# Altium schematic sheet 3_JetsonDRAMConnector.SchDoc
size 381 x 241 mm
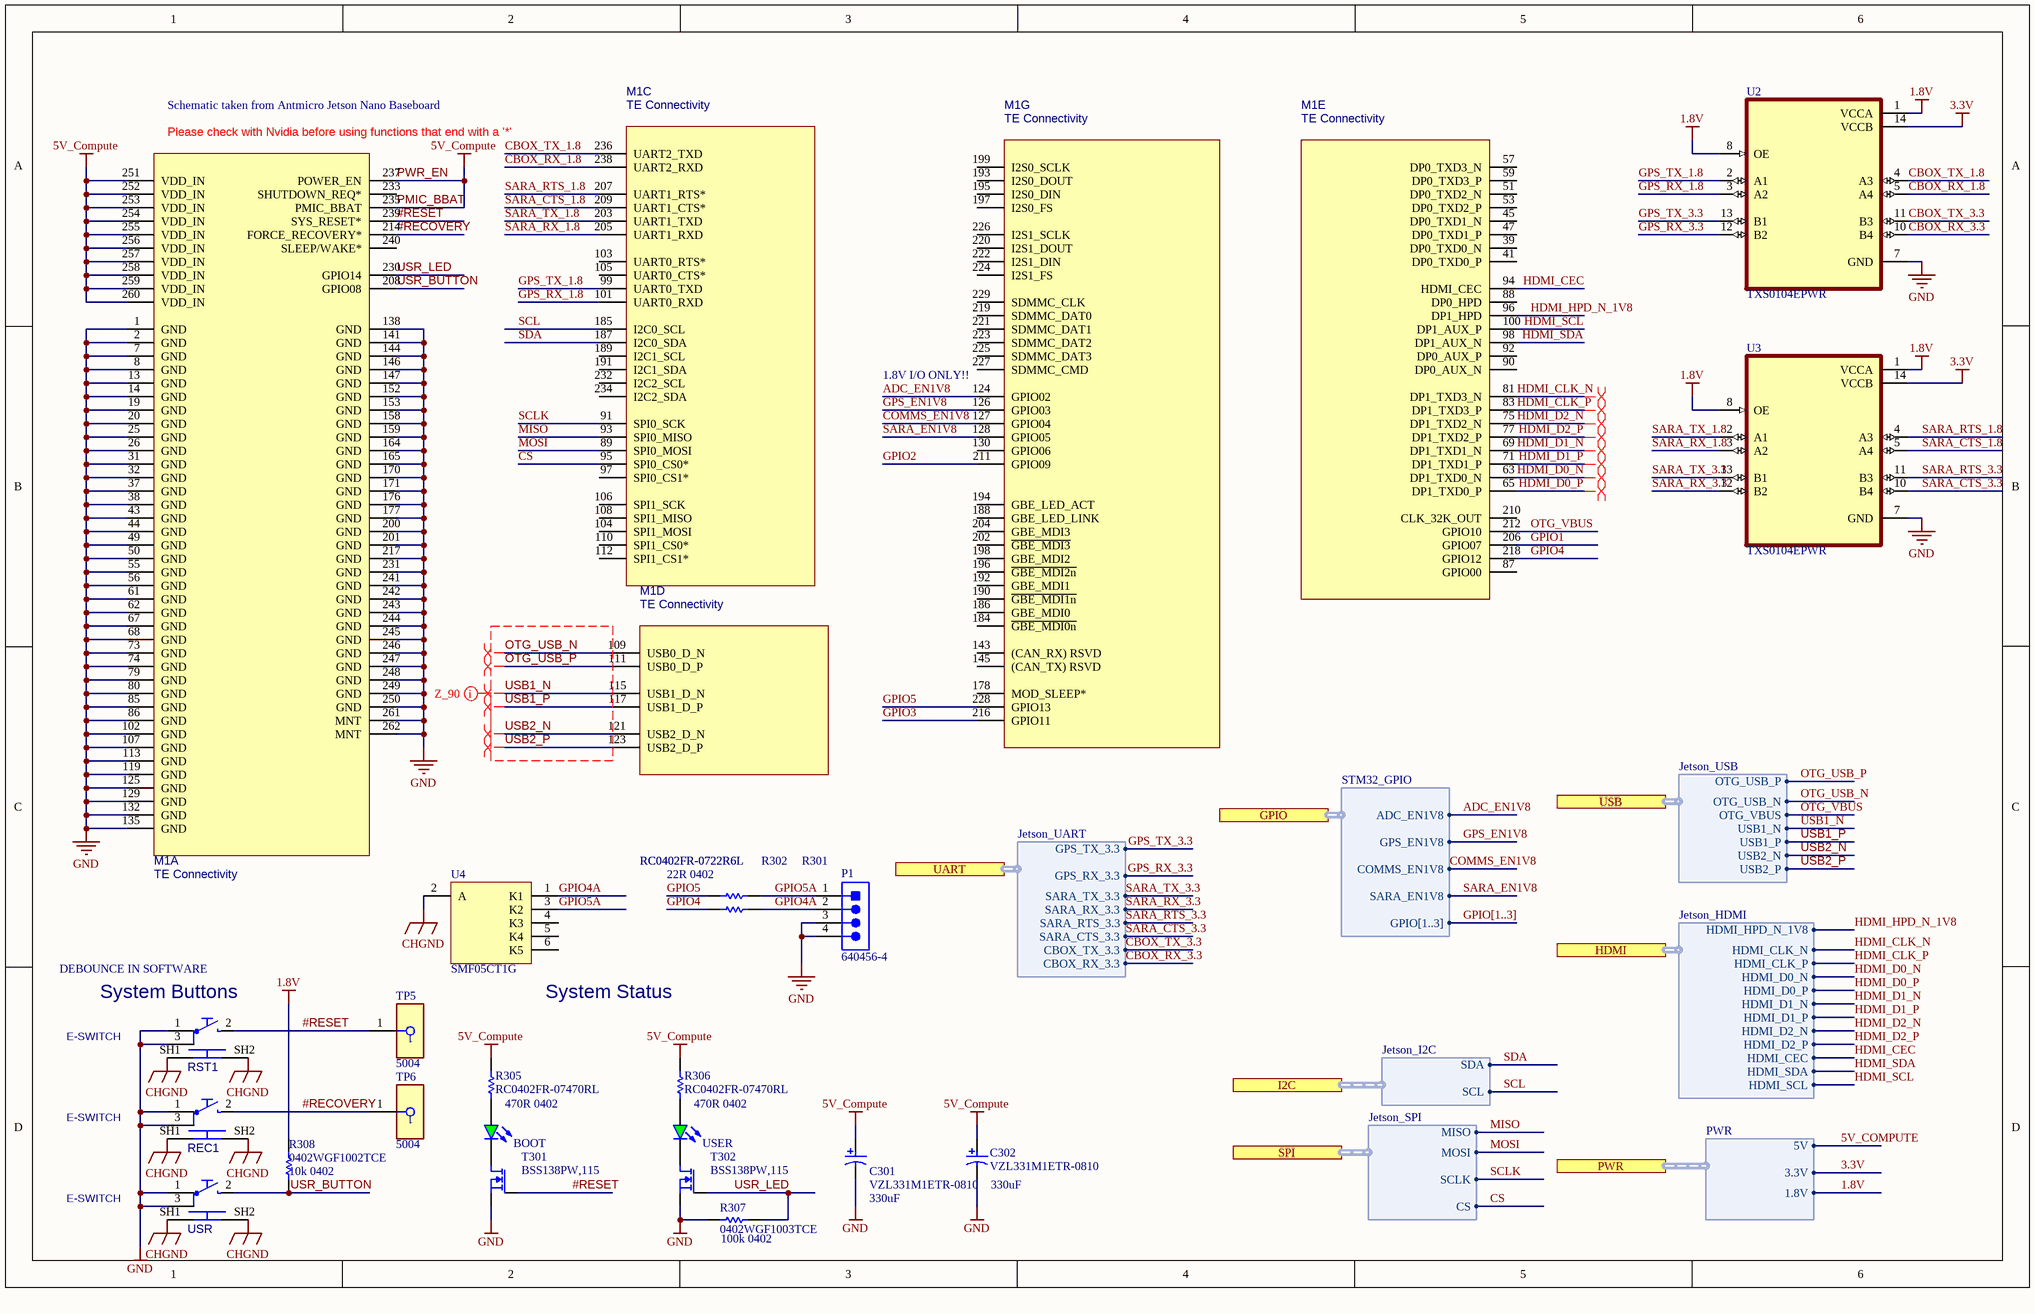
[diagram p0: 3_JetsonDRAMConnector.SchDoc]

## Parts
(Parts that share a designator on the sheet are numbered #1, #2 ... from top to bottom, then left to right.)
BOOT  APT1608SGC  [LED0603]  (value not drawn)
C301  VZL331M1ETR-0810  [NIC-CAPA2-8X10_V]
C302  VZL331M1ETR-0810  [NIC-CAPA2-8X10_V]
M1#1  Manufacturer: TE Connectivity  [jetson-nano-connector]  (hidden comment: 2309413-1)  (part E of 7)
M1#2  Manufacturer: TE Connectivity  [jetson-nano-connector]  (hidden comment: 2309413-1)  (parts A,C,D,G of 7)
P1  640456-4  [TECO-640456-4]
R301  RC0402FR-0722R6L  [0402]
R302  RC0402FR-0722R6L  [0402]
R305  RC0402FR-07470RL  [0402]
R306  RC0402FR-07470RL  [0402]
R307  0402WGF1003TCE  [0402]
R308  0402WGF1002TCE  [0402]
REC1  Manufacturer: E-SWITCH  [TL3340AF160QG]  (hidden comment: TL3340AF160QG)
RST1  Manufacturer: E-SWITCH  [TL3340AF160QG]  (hidden comment: TL3340AF160QG)
T301  BSS138PW,115  [SC70-3]
T302  BSS138PW,115  [SC70-3]
TP5  5004  [FP-5004-MFG]
TP6  5004  [FP-5004-MFG]
U2  TXS0104EPWR  [SOP65P640X120-14N]
U3  TXS0104EPWR  [SOP65P640X120-14N]
U4  SMF05CT1G  [ONSC-SC70-6-419B-02_W_V]
USER  APT1608SGC  [LED0603]  (value not drawn)
USR  Manufacturer: E-SWITCH  [TL3340AF160QG]  (hidden comment: TL3340AF160QG)

## Ports
GPIO (harness STM32_GPIO), HDMI (harness Jetson_HDMI), I2C (harness Jetson_I2C), PWR (harness PWR), SPI (harness Jetson_SPI), UART (harness Jetson_UART), USB (harness Jetson_USB)

## Harnesses
Jetson_UART: GPS_TX_3.3, GPS_RX_3.3, SARA_TX_3.3, SARA_RX_3.3, CBOX_TX_3.3, CBOX_RX_3.3, SARA_RTS_3.3, SARA_CTS_3.3
Jetson_I2C: SDA, SCL
Jetson_USB: OTG_USB_P, OTG_USB_N, USB1_N, USB1_P, USB2_N, USB2_P, OTG_VBUS
Jetson_SPI: MISO, MOSI, SCLK, CS
Jetson_HDMI: HDMI_HPD_N_1V8, HDMI_CLK_N, HDMI_CLK_P, HDMI_D0_N, HDMI_D0_P, HDMI_D1_N, HDMI_D1_P, HDMI_D2_N, HDMI_D2_P, HDMI_CEC, HDMI_SDA, HDMI_SCL
STM32_GPIO: ADC_EN1V8, GPS_EN1V8, COMMS_EN1V8, SARA_EN1V8, GPIO[1..3]
PWR: 5V, 3.3V, 1.8V

## Nets
1.8V: R308.1 U2.1(VCCA) U2.8(OE) U3.1(VCCA) U3.8(OE) ; port PWR.1.8V
3.3V: U2.14(VCCB) U3.14(VCCB) ; port PWR.3.3V
5V_COMPUTE: C301.1 C302.1 M1#2.235(PMIC_BBAT) M1#2.237(POWER_EN) M1#2.251(VDD_IN) M1#2.252(VDD_IN) M1#2.253(VDD_IN) M1#2.254(VDD_IN) M1#2.255(VDD_IN) M1#2.256(VDD_IN) M1#2.257(VDD_IN) M1#2.258(VDD_IN) M1#2.259(VDD_IN) M1#2.260(VDD_IN) R305.1 R306.1 ; port PWR.5V  [also labelled PMIC_BBAT, PWR_EN]
CHGND: REC1.SH1 REC1.SH2 RST1.SH1 RST1.SH2 U4.2(A) USR.SH1 USR.SH2
GND: C301.2 C302.2 M1#2.1(GND) M1#2.2(GND) M1#2.7(GND) M1#2.8(GND) M1#2.13(GND) M1#2.14(GND) M1#2.19(GND) M1#2.20(GND) M1#2.25(GND) M1#2.26(GND) M1#2.31(GND) M1#2.32(GND) M1#2.37(GND) M1#2.38(GND) M1#2.43(GND) M1#2.44(GND) M1#2.49(GND) M1#2.50(GND) M1#2.55(GND) M1#2.56(GND) M1#2.61(GND) M1#2.62(GND) M1#2.67(GND) M1#2.68(GND) M1#2.73(GND) M1#2.74(GND) M1#2.79(GND) M1#2.80(GND) M1#2.85(GND) M1#2.86(GND) M1#2.102(GND) M1#2.107(GND) M1#2.113(GND) M1#2.119(GND) M1#2.125(GND) M1#2.129(GND) M1#2.132(GND) M1#2.135(GND) M1#2.138(GND) M1#2.141(GND) M1#2.144(GND) M1#2.146(GND) M1#2.147(GND) M1#2.152(GND) M1#2.153(GND) M1#2.158(GND) M1#2.159(GND) M1#2.164(GND) M1#2.165(GND) M1#2.170(GND) M1#2.171(GND) M1#2.176(GND) M1#2.177(GND) M1#2.200(GND) M1#2.201(GND) M1#2.217(GND) M1#2.231(GND) M1#2.241(GND) M1#2.242(GND) M1#2.243(GND) M1#2.244(GND) M1#2.245(GND) M1#2.246(GND) M1#2.247(GND) M1#2.248(GND) M1#2.249(GND) M1#2.250(GND) M1#2.261(MNT) M1#2.262(MNT) P1.3 P1.4 R307.1 REC1.1 REC1.3 RST1.1 RST1.3 T301.2(S) T302.2(S) U2.7(GND) U3.7(GND) USR.1 USR.3
#RECOVERY: M1#2.214(FORCE_RECOVERY*) REC1.2 TP6.1
#RESET: M1#2.239(SYS_RESET*) RST1.2 T301.1(G) TP5.1
ADC_EN1V8: M1#2.124(GPIO02) ; port GPIO.ADC_EN1V8
CBOX_RX_1.8: M1#2.238(UART2_RXD) U2.5(A4)
CBOX_RX_3.3: U2.10(B4) ; port UART.CBOX_RX_3.3
CBOX_TX_1.8: M1#2.236(UART2_TXD) U2.4(A3)
CBOX_TX_3.3: U2.11(B3) ; port UART.CBOX_TX_3.3
COMMS_EN1V8: M1#2.127(GPIO04) ; port GPIO.COMMS_EN1V8
CS: M1#2.95(SPI0_CS0*) ; port SPI.CS
GPIO1: M1#1.206(GPIO07)
GPIO2: M1#2.211(GPIO09)
GPIO3: M1#2.216(GPIO11)
GPIO4: M1#1.218(GPIO12) R302.1
GPIO4A: P1.2 R302.2 U4.1(K1)
GPIO5: M1#2.228(GPIO13) R301.1
GPIO5A: P1.1 R301.2 U4.3(K2)
GPS_EN1V8: M1#2.126(GPIO03) ; port GPIO.GPS_EN1V8
GPS_RX_1.8: M1#2.101(UART0_RXD) U2.3(A2)
GPS_RX_3.3: U2.12(B2) ; port UART.GPS_RX_3.3
GPS_TX_1.8: M1#2.99(UART0_TXD) U2.2(A1)
GPS_TX_3.3: U2.13(B1) ; port UART.GPS_TX_3.3
HDMI_CEC: M1#1.94(HDMI_CEC) ; port HDMI.HDMI_CEC
HDMI_CLK_N: M1#1.81(DP1_TXD3_N) ; port HDMI.HDMI_CLK_N
HDMI_CLK_P: M1#1.83(DP1_TXD3_P) ; port HDMI.HDMI_CLK_P
HDMI_D0_N: M1#1.63(DP1_TXD0_N) ; port HDMI.HDMI_D0_N
HDMI_D0_P: M1#1.65(DP1_TXD0_P) ; port HDMI.HDMI_D0_P
HDMI_D1_N: M1#1.69(DP1_TXD1_N) ; port HDMI.HDMI_D1_N
HDMI_D1_P: M1#1.71(DP1_TXD1_P) ; port HDMI.HDMI_D1_P
HDMI_D2_N: M1#1.75(DP1_TXD2_N) ; port HDMI.HDMI_D2_N
HDMI_D2_P: M1#1.77(DP1_TXD2_P) ; port HDMI.HDMI_D2_P
HDMI_HPD_N_1V8: M1#1.96(DP1_HPD) ; port HDMI.HDMI_HPD_N_1V8
HDMI_SCL: M1#1.100(DP1_AUX_P) ; port HDMI.HDMI_SCL
HDMI_SDA: M1#1.98(DP1_AUX_N) ; port HDMI.HDMI_SDA
MISO: M1#2.93(SPI0_MISO) ; port SPI.MISO
MOSI: M1#2.89(SPI0_MOSI) ; port SPI.MOSI
OTG_USB_N: M1#2.109(USB0_D_N) ; port USB.OTG_USB_N
OTG_USB_P: M1#2.111(USB0_D_P) ; port USB.OTG_USB_P
OTG_VBUS: M1#1.212(GPIO10) ; port USB.OTG_VBUS
SARA_CTS_1.8: M1#2.209(UART1_CTS*) U3.5(A4)
SARA_CTS_3.3: U3.10(B4) ; port UART.SARA_CTS_3.3
SARA_EN1V8: M1#2.128(GPIO05) ; port GPIO.SARA_EN1V8
SARA_RTS_1.8: M1#2.207(UART1_RTS*) U3.4(A3)
SARA_RTS_3.3: U3.11(B3) ; port UART.SARA_RTS_3.3
SARA_RX_1.8: M1#2.205(UART1_RXD) U3.3(A2)
SARA_RX_3.3: U3.12(B2) ; port UART.SARA_RX_3.3
SARA_TX_1.8: M1#2.203(UART1_TXD) U3.2(A1)
SARA_TX_3.3: U3.13(B1) ; port UART.SARA_TX_3.3
SCL: M1#2.185(I2C0_SCL) ; port I2C.SCL
SCLK: M1#2.91(SPI0_SCK) ; port SPI.SCLK
SDA: M1#2.187(I2C0_SDA) ; port I2C.SDA
USB1_N: M1#2.115(USB1_D_N) ; port USB.USB1_N
USB1_P: M1#2.117(USB1_D_P) ; port USB.USB1_P
USB2_N: M1#2.121(USB2_D_N) ; port USB.USB2_N
USB2_P: M1#2.123(USB2_D_P) ; port USB.USB2_P
USR_BUTTON: M1#2.208(GPIO08) R308.2 USR.2
USR_LED: M1#2.230(GPIO14) R307.2 T302.1(G)
NetBOOT_A: BOOT.A R305.2
NetBOOT_K: BOOT.K T301.3(D)
NetR306_2: R306.2 USER.A
NetT302_3: T302.3(D) USER.K

Not connected (* = marked no-connect by the designer): M1#1 39(DP0_TXD0_N) 41(DP0_TXD0_P) 45(DP0_TXD1_N) 47(DP0_TXD1_P) 51(DP0_TXD2_N) 53(DP0_TXD2_P) 57(DP0_TXD3_N) 59(DP0_TXD3_P) 87(GPIO00) 88(DP0_HPD) 90(DP0_AUX_N) 92(DP0_AUX_P) 210(CLK_32K_OUT); M1#2 97(SPI0_CS1*) 103(UART0_RTS*) 104(SPI1_MOSI) 105(UART0_CTS*) 106(SPI1_SCK) 108(SPI1_MISO) 110(SPI1_CS0*) 112(SPI1_CS1*) 130(GPIO06) 143((CAN_RX)_RSVD) 145((CAN_TX)_RSVD) 178(MOD_SLEEP*) 184(~{GBE_MDI0n}) 186(GBE_MDI0) 188(GBE_LED_LINK) 189(I2C1_SCL) 190(~{GBE_MDI1n}) 191(I2C1_SDA) 192(GBE_MDI1) 193(I2S0_DOUT) 194(GBE_LED_ACT) 195(I2S0_DIN) 196(~{GBE_MDI2n}) 197(I2S0_FS) 198(GBE_MDI2) 199(I2S0_SCLK) 202(~{GBE_MDI3}) 204(GBE_MDI3) 219(SDMMC_DAT0) 220(I2S1_DOUT) 221(SDMMC_DAT1) 222(I2S1_DIN) 223(SDMMC_DAT2) 224(I2S1_FS) 225(SDMMC_DAT3) 226(I2S1_SCLK) 227(SDMMC_CMD) 229(SDMMC_CLK) 232(I2C2_SCL) 233(SHUTDOWN_REQ*) 234(I2C2_SDA) 240(SLEEP/WAKE*); U4 4(K3) 5(K4) 6(K5)

## Buses and harness runs
bus GPIO[1..3]

## Layout directives
net class Z_90: OTG_USB_N, OTG_USB_P, USB1_N, USB1_P, USB2_N, USB2_P
differential pair: HDMI_CLK_N, HDMI_CLK_P, HDMI_D0_N, HDMI_D0_P, HDMI_D1_N, HDMI_D1_P, HDMI_D2_N, HDMI_D2_P, OTG_USB_N, OTG_USB_P, USB1_N, USB1_P, USB2_N, USB2_P

## Notes on the sheet
- Schematic taken from Antmicro Jetson Nano Baseboard
- (near M1#2) 1.8V I/O ONLY!!
- (near R301) 22R 0402
- DEBOUNCE IN SOFTWARE
- (near RST1) System Buttons
- (near U4) System Status
- 470R 0402
- (near R308) 10k 0402
- (near R307) 100k 0402
- (near C301) 330uF
- (near C302) 330uF
- (in symbol jetson-nano-new-release, part A) Please check with Nvidia before using functions that end with a '*'

## Library data of the parts
BOOT USER = LED: LED Green 0603 case; PartNumber: LED_G; Manufacturer: KINGBRIGHT; Value: APT1608SGC; MPN: APT1608SGC
C301 C302 = CMP-0687-00072-1: Aluminum Electrolytic Capacitor, UD Series, Low Impedance, 330 uF, 10 V, + / - 20%, -55 to 105 degC, Chip Type, 8 x 10 mm D x L, Pb-Free, Reel; PartNumber: UUD1A331MNL1GS; Manufacturer: Nichicon; Rated Capacitance: 330 uF; Packing: Dia382mm Reel; Tolerance Rated Capacitance: -20 to 20%; Endurance Time: 5000 h; Rated Ripple Current (at 100kHz): 450 mA; Rated Voltage: 10 V; Impedance: 0.17 Ohm; ComponentLink1URL: http://www.nichicon.co.jp/; DatasheetVersion: 08/2012; ComponentLink2URL: http://products.nichicon.co.jp/en/pdf/XJA043/e-ud.pdf; Diameter: 8 mm; ComponentLink1Description: Manufacturer URL; PackageDescription: 2-Pin Surface Mount Device, Diameter 8 mm, Height 10 mm, Pitch 6.5 mm; Mounting Technology: Surface Mount; ComponentLink3URL: http://products.nichicon.co.jp/en/pdf/XJA043/e-ud.pdf; ComponentLink3Description: Package Specification; Length: 10 mm; ComponentLink2Description: Datasheet; PackageReference: CAPAE-D8H10; RoHS: TRUE
M1#1 M1#2 = jetson-nano-new-release: PartNumber: 2309413-1; Value: 2309413-1; MPN: 2309413-1
P1 = CMP-2000-05419-1: Male Header, Pitch 2.54 mm, 1 x 4 Position, Height 10.03 mm, Tail Length 3.56 mm, RoHS, Bulk; Manufacturer: TE Connectivity; Material, Housing: Polyester; Primary Type: InterconnectSystem; Mount Angle: Vertical; Color, Housing: White; Current, Rating: 5 / A; Agency Approvals: CSA,UL; Contact Termination Area Plating: Tin; Temperature, Operating: -55to+105 / degC; Standards: RoHSCompliant,ELVCompliant,UL94V-0; Number of Positions: 4; Brand/Series: MTA-100Series; Angle: Straight; Pin Spacing: 0.1 / "; Material, Contact: CopperAlloy; Connector Type: MTA-100; Special Features: Pinstrip; Mounting Hole Size: 0.04 / "; Contact Centerline Spacing: 0.100 / in.; Voltage, Rating: 250 / V; Manufacturer URL: http://www.te.com/; Length, Pin: 0.14 / "; Length, Overall: 0.4 / "; Color: White; Flammability Rating: UL94V-0; Mounting Type: PCMount; Termination: Solder; Datasheet URL: https://datasheet.ciiva.com/16286/eng-ds-82056-mta-0608-16286228.pdf; Number of Contacts: 4; Contact Shape: Square; Contact Mating Area Plating: Tin; Length, Terminal Post: 0.14 / in.; Size, Post: 0.025 / in.; Contact Plating: Tin; Type: PCBPlug; Datasheet Version: Dec-14; Number of Rows: 1
R301 R302 = Res1: 22R 0402; Published: 8-Jun-2000; LatestRevisionDate: 17-Jul-2002; LatestRevisionNote: Re-released for DXP Platform.; PackageReference: AXIAL-0.3; Publisher: Altium Limited; PackageDescription: Axial Device, Thru-Hole; 2 Leads; 0.3 in Pin Spacing; Case Code (Imperial): 0402
R305 R306 = Res1: 470R 0402; Published: 8-Jun-2000; LatestRevisionDate: 17-Jul-2002; LatestRevisionNote: Re-released for DXP Platform.; PackageReference: AXIAL-0.3; Publisher: Altium Limited; PackageDescription: Axial Device, Thru-Hole; 2 Leads; 0.3 in Pin Spacing; Case Code (Imperial): 0402
R307 = Res1: 100k 0402; Published: 8-Jun-2000; LatestRevisionDate: 17-Jul-2002; LatestRevisionNote: Re-released for DXP Platform.; PackageReference: AXIAL-0.3; Publisher: Altium Limited; PackageDescription: Axial Device, Thru-Hole; 2 Leads; 0.3 in Pin Spacing; Case Code (Imperial): 0402
R308 = Res1: 10k 0402; Published: 8-Jun-2000; LatestRevisionDate: 17-Jul-2002; LatestRevisionNote: Re-released for DXP Platform.; PackageReference: AXIAL-0.3; Publisher: Altium Limited; PackageDescription: Axial Device, Thru-Hole; 2 Leads; 0.3 in Pin Spacing; Case Code (Imperial): 0402
REC1 RST1 USR = TL3340AF160QG: E-SWITCH  TL3340AF160QG  SWITCH, TACTILE SPST 50mA, SMD GULL WING; Value: TL3340AF160QG; PartNumber: TL3340AF160QG; MPN: TL3340AF160QG
T301 T302 = NMOS: MOSFET, N CH, 60V, 0.2A; Manufacturer: NXP; Value: BSS138PW,115; PartNumber: BSS138PW,115; MPN: BSS138PW,115
TP5 TP6 = CMP-2000-05575-2: PC TEST POINT MINIATURE YELLOW; Manufacturer: Keystone; Number Of Contacts: 1; Is Female: yes; Device Class L1: Connectors; Manufacturer Part Number: 5004; Digikey Description: PC TEST POINT MINIATURE YELLOW; ComponentLink2URL: https://www.keyelco.com/product-pdf.cfm?p=1313; Lead Free: Yes; ComponentLink2Description: Datasheet; Category: Conn; Height: 4.72mm; Octopart: https://octopart.com/5004-keystone-28591; Mouser Description: TEST POINT PC MINI .040"D YELLOW; Device Class L3: unset; Contact Material: Silver; Package: 5004; Automotive: No; Device Class L2: unset; RoHS: TRUE
U2 U3 = TXS0104EPWR: 4-Bit Bidirectional Voltage-Level Shifter for Open-Drain and Push-Pull Applications 14-TSSOP -40 to 85; MF: Texas Instruments; Availability: Unavailable; Price: None; MP: TXS0104EPWR; Package: TSSOP-14 Texas Instruments; SnapEDA_Link: https://www.snapeda.com/parts/TXS0104EPWR/Texas%20Instruments/view-part/134341/?ref=snap; Value: *; Texas_Instruments-Purchase-URL: https://snapeda.com/shop?store=Texas+Instruments&id=134341
U4 = CMP-1061-00155-1: 5-Line Transient Voltage Suppressor Array, 6-Pin SC70, Pb-Free, Tape and Reel; Manufacturer: On Semiconductor; PPK Max (W): 100; Direction: Unidirectional; IR Max (uA): 5; PackageDescription: 6-Pin Small Outline Transistor, Body 2 x 1.25 mm, Pitch 0.65 mm; PackageReference: SC70-6-419B-02_W; ComponentLink2Description: Datasheet; Mounting Technology: Surface Mount; Packing: Tape and Reel; DatasheetVersion: Rev. 4; ComponentLink1Description: Manufacturer URL; ComponentLink2URL: http://www.onsemi.com/pub_link/Collateral/SMF05C-D.PDF; ComponentLink3Description: Package Specification; ComponentLink1URL: http://www.onsemi.com/; ComponentLink3URL: http://www.onsemi.com/pub_link/Collateral/SMF05C-D.PDF; PackageVersion: Rev. W; PartNumber: SMF05CT1G; RoHS: Pb-Free